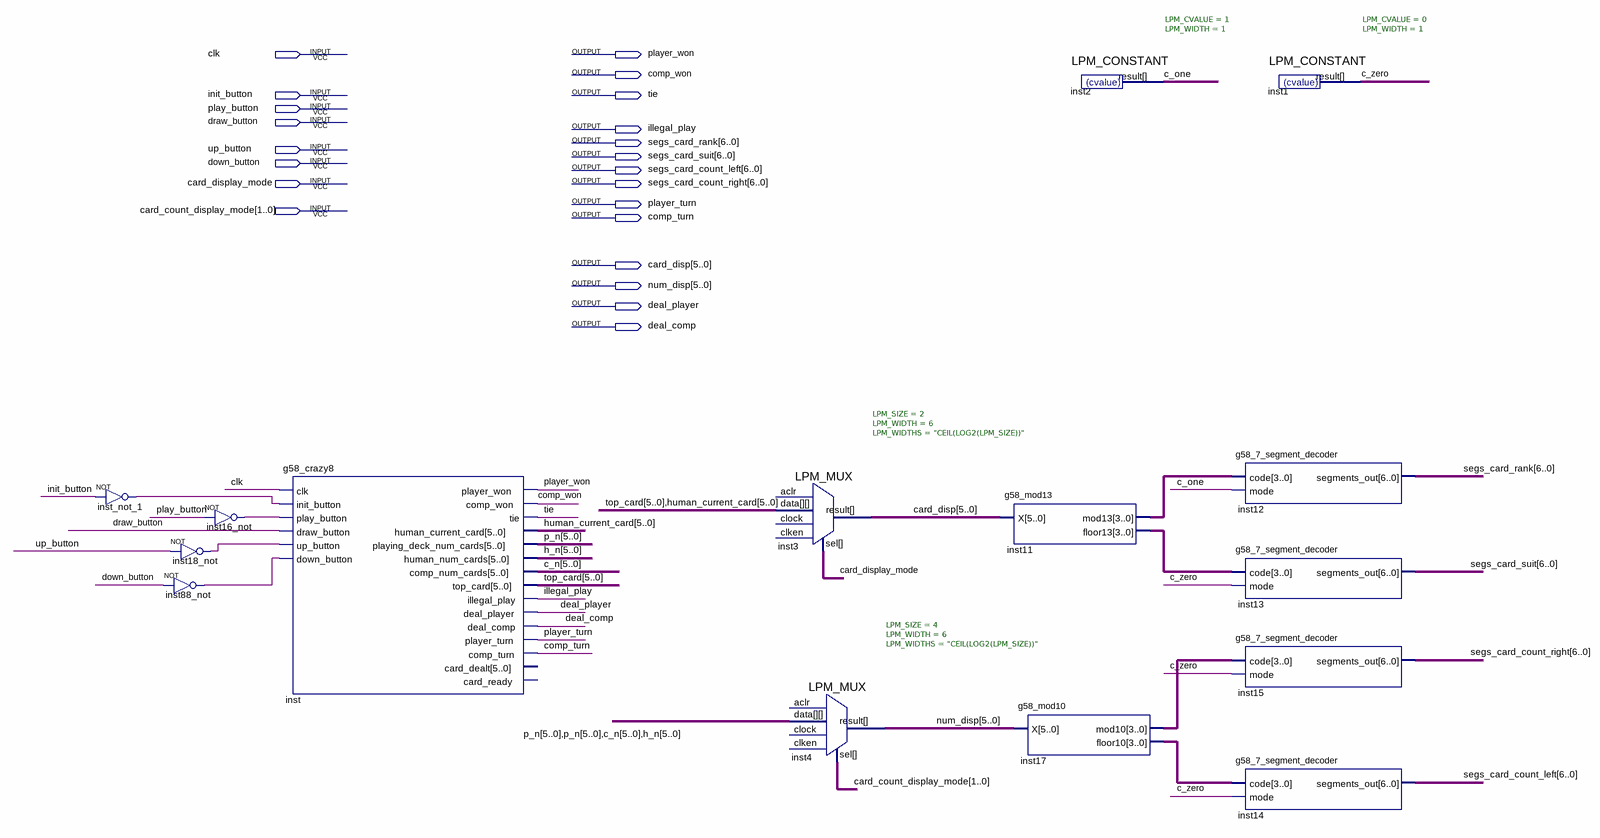
[diagram p0: schematic sheet]
// Quartus schematic g58_crazy8_complete.bdf as structural Verilog: 15 symbols, 22 pins
module g58_crazy8_complete (
  input  clk,
  input  init_button,
  input  play_button,
  input  draw_button,
  input  up_button,
  input  down_button,
  input  card_display_mode,
  input  [1:0] card_count_display_mode,
  output player_won,
  output comp_won,
  output tie,
  output illegal_play,
  output [6:0] segs_card_rank,
  output [6:0] segs_card_suit,
  output [6:0] segs_card_count_left,
  output [6:0] segs_card_count_right,
  output player_turn,
  output comp_turn,
  output [5:0] card_disp,
  output [5:0] num_disp,
  output deal_player,
  output deal_comp
);

  wire c_one, c_zero, inst16_not_out, inst18_not_out, inst88_not_out, inst_not_1_out;
  wire [3:0] inst11_floor13, inst11_mod13, inst17_floor10, inst17_mod10;
  wire [5:0] c_n, h_n, human_current_card, p_n, top_card;

  not inst_not_1 (inst_not_1_out, init_button);
  not inst18_not (inst18_not_out, up_button);
  not inst88_not (inst88_not_out, down_button);
  not inst16_not (inst16_not_out, play_button);
  g58_crazy8 inst (
    .clk(clk), .init_button(inst_not_1_out), .play_button(inst16_not_out), .draw_button(draw_button),
    .up_button(inst18_not_out), .down_button(inst88_not_out), .player_won(player_won), .comp_won(comp_won),
    .tie(tie), .human_current_card(human_current_card), .playing_deck_num_cards(p_n), .human_num_cards(h_n),
    .comp_num_cards(c_n), .top_card(top_card), .illegal_play(illegal_play), .deal_player(deal_player),
    .deal_comp(deal_comp), .player_turn(player_turn), .comp_turn(comp_turn));  // open: card_dealt, card_ready
  LPM_MUX #(.LPM_SIZE(2), .LPM_WIDTH(6), .LPM_WIDTHS("CEIL(LOG2(LPM_SIZE))")) inst3 (
    .data({top_card, human_current_card}), .sel(card_display_mode), .result(card_disp));  // open: clock, aclr, clken
  LPM_MUX #(.LPM_SIZE(4), .LPM_WIDTH(6), .LPM_WIDTHS("CEIL(LOG2(LPM_SIZE))")) inst4 (
    .data({p_n, p_n, c_n, h_n}), .sel(card_count_display_mode), .result(num_disp));  // open: clock, aclr, clken
  g58_mod13 inst11 (.X(card_disp), .mod13(inst11_mod13), .floor13(inst11_floor13));
  g58_mod10 inst17 (.X(num_disp), .mod10(inst17_mod10), .floor10(inst17_floor10));
  LPM_CONSTANT #(.LPM_CVALUE(1), .LPM_WIDTH(1)) inst2 (.result(c_one));
  g58_7_segment_decoder inst12 (.code(inst11_mod13), .mode(c_one), .segments_out(segs_card_rank));
  g58_7_segment_decoder inst13 (.code(inst11_floor13), .mode(c_zero), .segments_out(segs_card_suit));
  g58_7_segment_decoder inst15 (.code(inst17_mod10), .mode(c_zero), .segments_out(segs_card_count_right));
  g58_7_segment_decoder inst14 (.code(inst17_floor10), .mode(c_zero), .segments_out(segs_card_count_left));
  LPM_CONSTANT #(.LPM_CVALUE(0), .LPM_WIDTH(1)) inst1 (.result(c_zero));
endmodule
